# EAGLE design egle (EAGLE 5.11)
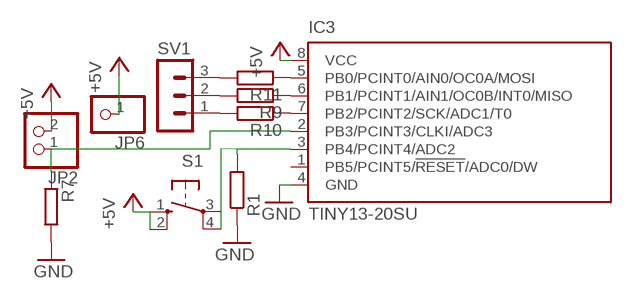
[diagram p0: schematic, sheet 1]

## Parts
IC3  TINY13-20SU  [8S2]
JP2  PINHD-1X2  [1X02]
JP6  PINHD-1X1  [1X01]
R1  R-EU_R1005  [R1005]
R7  R-EU_R1005  [R1005]
R9  R-EU_R1005  [R1005]
R10  R-EU_R1005  [R1005]
R11  R-EU_R1005  [R1005]
S1  10-XX  [B3F-10XX]
SV1  MA03-1  [MA03-1]

## Nets
+5V: IC3.8(VCC) JP2.2 JP6.1 S1.1(S) S1.2(S1)
GND: IC3.4(GND) R1.1 R7.2
N$1: IC3.2(PB3/PCINT3/CLKI/ADC3) JP2.1 R7.1
N$2: R11.2 SV1.3
N$4: R9.2 SV1.2
N$5: R10.2 SV1.1
N$6: IC3.7(PB2/PCINT2/SCK/ADC1/T0) R10.1
N$7: IC3.6(PB1/PCINT1/AIN1/OC0B/INT0/MISO) R9.1
N$8: IC3.5(PB0/PCINT0/AIN0/OC0A/MOSI) R11.1
N$10: IC3.3(PB4/PCINT4/ADC2) R1.2 S1.3(P) S1.4(P1)
Unconnected: IC3.1(PB5/PCINT5/!RESET!/ADC0/DW)

## Library data of the parts
IC3 = atmel:TINY13: 8-bit AVR Microcontroller with 1K Bytes In-System Programmable Flash Source: http://www.atmel.com/dyn/resources/prod_documents/2535S.pdf; MPN: ATTINY13-20SU; OC_FARNELL: 9171568; OC_NEWARK: 96K6522
JP2 = pinhead:PINHD-1X2: PIN HEADER
JP6 = pinhead:PINHD-1X1: PIN HEADER
R1 R7 R9-R11 = rcl:R-EU_: RESISTOR, European symbol
S1 = switch-omron:10-XX: OMRON SWITCH; MPN: B3F-1000; OC_FARNELL: 176432; OC_NEWARK: 36M3542
SV1 = con-lstb:MA03-1: PIN HEADER; OC_FARNELL: unknown; OC_NEWARK: unknown

## Board
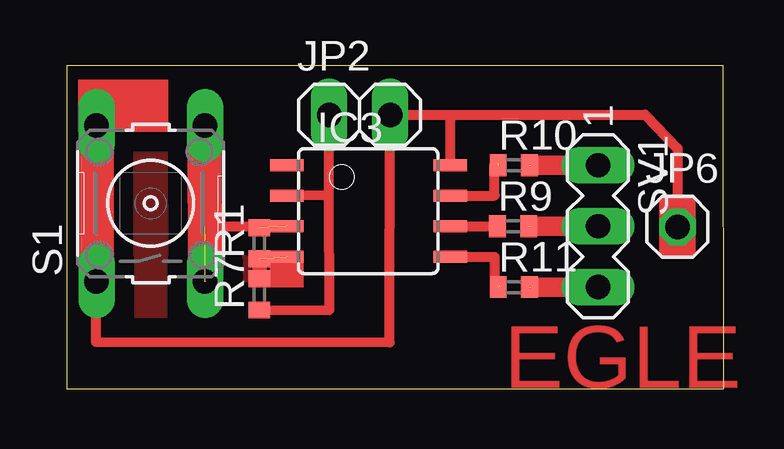
[diagram p1: board, top side]

Size 27.41 x 13.47 mm. Coordinates in mm from the lower left corner, seen from the top.
Outline: 0,0.01 27.41,0 27.39,13.46 0,13.47 0,0.01
Copper layers (1*16): Top 0.035mm / dielectric 1.5mm / Bottom 0.035mm
Design rules "default": minimum track width 10mil, minimum drill 24mil, track to track 8mil, track to pad 8mil, pad to pad 8mil, via to via 8mil, smd to smd 8mil, copper to edge 40mil, drill to drill 8mil, minimum pad ring 10mil, minimum via ring 8mil, stop-mask expansion 4mil, vias tented up to drill 0mil, thermal gap 10mil
tRestrict: area 14.4,1.6 to 17,3.5; area 24.6,3.6 to 26.1,4.6; area 6.9,10.4 to 9.6,12.2

### Footprints (pad centres in the part's own frame; a part is rotated, then mirrored left to right if it is on the bottom)
8S2 = smd 0.5 x 1.4: 1 -1.905,-3.404; 2 -0.645,-3.404; 3 0.625,-3.404; 4 1.895,-3.404; 5 1.905,3.404; 6 0.635,3.404; 7 -0.635,3.404; 8 -1.905,3.404
1X02 = drill 1.016 long: 1 -1.27,0; 2 1.27,0
1X01 = drill 1.016 octagon: 1 0,0
R1005 = smd 0.7 x 0.9: 1 -0.65,0; 2 0.65,0
B3F-10XX = drill 1.016 long: 1 -3.251,2.261; 2 3.251,2.261; 3 -3.251,-2.261; 4 3.251,-2.261
MA03-1 = drill 1.016 long: 1 -2.54,0; 2 0,0; 3 2.54,0

### Placement (x,y rotation side)
IC3  12.59,7.41 270 top
JP2  12.22,11.42 0 top
JP6  25.47,6.75 0 top
R1  8.04,6.07 90 top
R7  8.04,3.94 90 top
R9  18.62,6.78 0 top
R10  18.65,9.32 0 top
R11  18.65,4.24 0 top
S1  3.51,7.73 90 top
SV1  22.16,6.78 270 top

### Tracks (layer width: path | path; a pad name or v marks a point on that pad's centre or on a via)
+5V
  Top 0.406: JP6.1 25.47,10.03 24.13,11.43 15.99,11.42 | 15.99,11.42 JP2.2 13.47,1.94 1.23,1.96 1.25,10.84 | 15.99,11.42 IC3.8
  Top 1.422: S1.1 1.25,10.84 S1.2
GND  (1 unrouted)
  Top 0.61: R7.2 R1.1
  pour Top (isolate 0.813): 0.11,13.53 27.37,13.38 27.38,0.01 -0.05,-0.04
N$1
  Top 0.406: R7.1 10.96,3.28 10.94,8.07 | 10.94,8.07 IC3.2 | 10.94,8.07 JP2.1
N$2  (1 unrouted)
  Top 0.813: 19.36,4.24 SV1.3
N$4  (1 unrouted)
  Top 0.813: 19.33,6.78 SV1.2
N$5  (1 unrouted)
  Top 0.813: 19.36,9.32 SV1.1
N$6  (1 unrouted)
  Top 0.406: IC3.7 16.52,8.04 17.85,8.05 17.85,9.38 17.98,9.38
N$7
  Top 0.406: IC3.6 R9.1
N$8  (1 unrouted)
  Top 0.406: IC3.5 17.85,5.5 17.85,4.29 18.04,4.28
N$10  (3 unrouted)
  Top 0.406: IC3.3 5.77,6.79 5.77,7.52
  Top 1.422: S1.4 S1.3
(copper drawn outside any net)
  shapes: Top area x3

### Text on the board
Top: EGLE